# Altium schematic sheet Communication.SchDoc
size A4; ApprovedBy: G. Zeitune; CheckedBy: J. Fiszman; DrawnBy: M. Mainenti; DocumentNumber: 1; Revision: 2; SheetNumber: 1; SheetTotal: 1
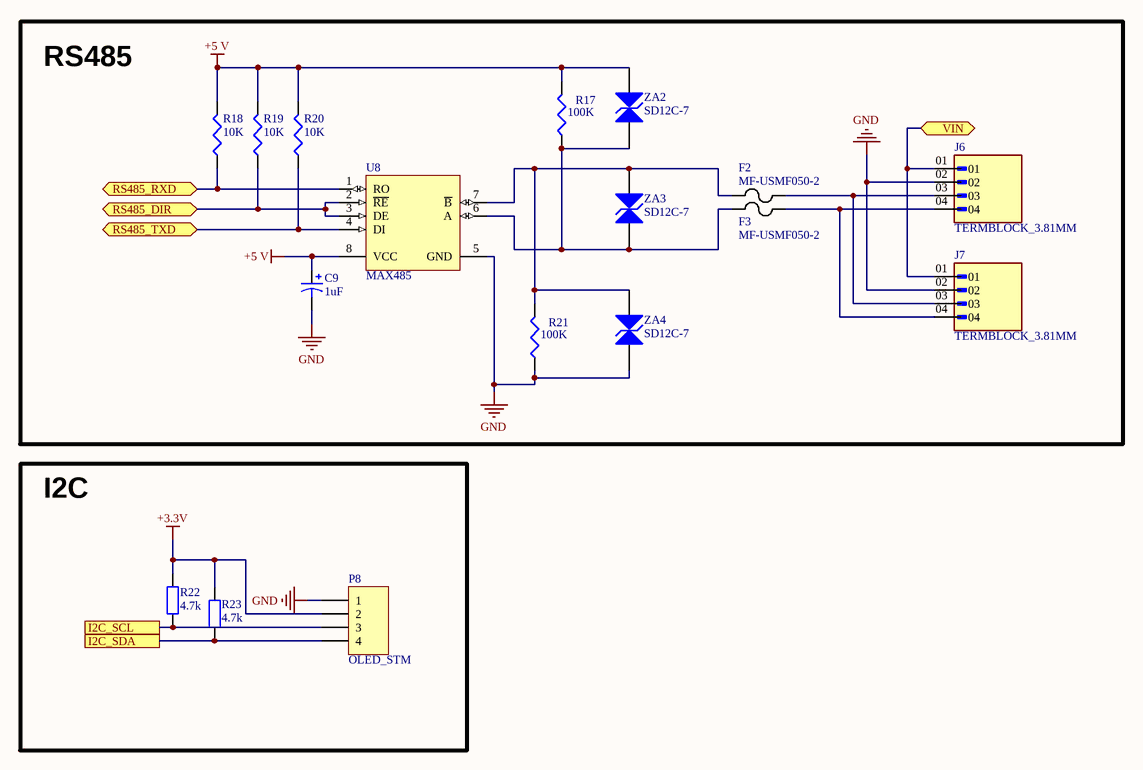
[diagram p0: Communication.SchDoc]

## Parts
C9  1uF  [CAPC3225N]
F2  MF-USMF050-2  [MF-USMF050-2]
F3  MF-USMF050-2  [MF-USMF050-2]
J6  TERMBLOCK_3.81MM  [TERMBLOCK_3.81MM_90DEG_4POS]
J7  TERMBLOCK_3.81MM  [TERMBLOCK_3.81MM_90DEG_4POS]
P8  OLED_STM  [CONNHDR_1X4_2.54MM]
R17  100K  [RESC2012N]
R18  10K  [RESC2012N]
R19  10K  [RESC2012N]
R20  10K  [RESC2012N]
R21  100K  [RESC2012N]
R22  4.7k  [RESC2012N]
R23  4.7k  [RESC2012N]
U8  MAX485  [MAX485]
ZA2  SD12C-7  [SOD-323]
ZA3  SD12C-7  [SOD-323]
ZA4  SD12C-7  [SOD-323]

## Blocks framed on the sheet
RS485: C9 F2 F3 J6 J7 R17-R21 U8 ZA2-ZA4
I2C: P8 R22 R23

## Ports
I2C_SCL, I2C_SDA, RS485_DIR (bidir), RS485_RXD (bidir), RS485_TXD (bidir), VIN

## Nets
+3.3V: P8.2 R22.2 R23.2
+5 V: C9.1 R17.2 R18.2 R19.2 R20.2 U8.8(VCC) ZA2.1
GND: C9.2 J6.02 J7.02 P8.1 R21.1 U8.5(GND) ZA4.2
I2C_SCL: P8.3 R22.1 ; port I2C_SCL
I2C_SDA: P8.4 R23.1 ; port I2C_SDA
RS485_DIR: R19.1 U8.2(~{RE}) U8.3(DE) ; port RS485_DIR
RS485_RXD: R18.1 U8.1(RO) ; port RS485_RXD
RS485_TXD: R20.1 U8.4(DI) ; port RS485_TXD
VIN: J6.01 J7.01 ; port VIN
NetF2_1: F2.1 R21.2 U8.7(~{B}) ZA3.1 ZA4.1
NetF2_2: F2.2 J6.03 J7.03
NetF3_1: F3.1 R17.1 U8.6(A) ZA2.2 ZA3.2
NetF3_2: F3.2 J6.04 J7.04

## Notes on the sheet
- Title
- Size:
- Date:
- A4
- Number:
- Time:
- Revision:
- Sheet
- of
- File:

## Library data of the parts
C9 = Cap Pol3: Polarized Capacitor (Surface Mount); Value: 0.1uF; Published: 8-Jun-2000; LatestRevisionDate: 29-May-2009; LatestRevisionNote: IPC-7351 Footprint Added.; PackageReference: C0805; Publisher: Altium Limited; PackageDescription: Chip Capacitor
F2 F3 = PTS18126V300: PTC RESET FUSE 6V 3A 1812; Mfr_Name: Eaton
J6 J7 = TERMBLOCK_3.81MM_90DEG_4POS: TERMBLOCK_3.81MM_90DEG_4POS (DigiKey: 1803293)
P8 = MHDR1X4: Header, 4-Pin; LatestRevisionDate: 17-Jul-2002; LatestRevisionNote: Re-released for DXP Platform.; Publisher: Altium Limited
R17-R21 = Res3: Resistor; Published: 8-Jun-2000; LatestRevisionDate: 29-May-2009; LatestRevisionNote: IPC-7351 Footprint Added.; PackageReference: J1-0603; Publisher: Altium Limited; PackageDescription: Chip Resistor
  R17 R21: Value: 100K
  R18-R20: Value: 10K
R22 R23 = Res2: Resistor; Value: 1K; Published: 8-Jun-2000; LatestRevisionDate: 17-Jul-2002; LatestRevisionNote: Re-released for DXP Platform.; PackageReference: AXIAL-0.4; Publisher: Altium Limited; PackageDescription: Axial Device, Thru-Hole; 2 Leads; 0.4 in Pin Spacing
U8 = MAX485: Low-Power RS-485/RS-422 Multipoint Transceiver, 8-pin Narrow SOIC
ZA2-ZA4 = TVS Diode: Transient voltage suppressor diode